# Altium schematic sheet Sch_2_layers.SchDoc
size A
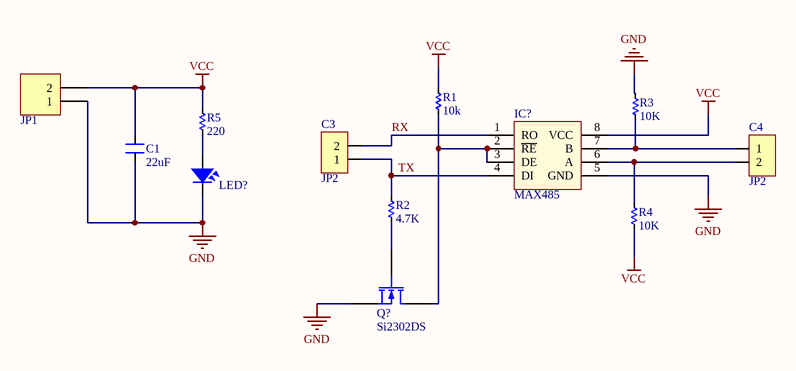
[diagram p0: Sch_2_layers.SchDoc]

## Parts
C1  22uF  [SM-CAP-0805]
C3  JP2  [JP2-D1T]
C4  JP2  [JP2-D1T]
IC?  MAX485  [SO-8]
JP1  Header 2_1  [HED2]  (value not drawn)
LED?  LED SMD  [SM-LED-0805-Blue]  (value not drawn)
Q?  Si2302DS  [SOT23]
R1  10k  [RES-SMD-0805]
R2  4.7K  [RES-SMD-0805]
R3  10K  [RES-SMD-0805]
R4  10K  [RES-SMD-0805]
R5  220  [RES-SMD-0805]

## Nets
GND: C1.1 IC?.5(GND) JP1.1 LED?.2 Q?.2(S) R3.1
VCC: C1.2 IC?.8(VCC) JP1.2 R1.1 R4.2 R5.1
RX: C3.2 IC?.1(RO)
TX: C3.1 IC?.4(DI) R2.1
NetC4_1: C4.1 IC?.7(B) R3.2
NetC4_2: C4.2 IC?.6(A) R4.1
NetIC?_2: IC?.2(~{RE}) IC?.3(DE) Q?.3(D) R1.2
NetLED?_1: LED?.1 R5.2
NetQ?_1: Q?.1(G) R2.2

## Library data of the parts
C1 = CN: Value: 0,1uF/300V; Designed by: VanDungEvn
C3 C4 = JP2: WR-PHD 2.54 mm Angled Socket Header; Manufacturer: W¨¹rth Elektronik eiSos GmbH; partNo: 613002143121; ComponentLink1 Description: Manufacturer; ComponentLink2 Description: Datasheet; NoPins: 02; Created Date: 29 March 2013; ComponentLink1URL: http://www.we-online.com; ComponentLink2URL: http://katalog.we-online.de/em/datasheet/6130xx143121.pdf; Created by: Karrer Zheng
IC? = MAX485: RS232 - RS485 (Same sn75176)
JP1 = Header 2_1: Header, 2-Pin; Manufacturer: Generic Components; Class: Connector; Value: Header 2
LED? = LED-SMD-0805
Q? = Si2302DS: N-Channel MOSFET; Published: 8-Jun-2000; LatestRevisionDate: 17-Jul-2002; LatestRevisionNote: Re-released for DXP Platform.; PackageVersion: 1995/1996; PackageReference: E3; Publisher: Altium Limited; PackageDescription: TO, Flat Index; 3 In-Line, Axial Leads; Body Dia. 4.6mm; Lead Dia. 0.5 mm (max)
R1-R5 = Res: Manufacturer: Generic Components; Class: Passive; SubClass: R; Published: 08/06/2000; Publisher: Altium Hobart Technology Centre